# Altium schematic sheet IO_CONN.SchDoc
size A4
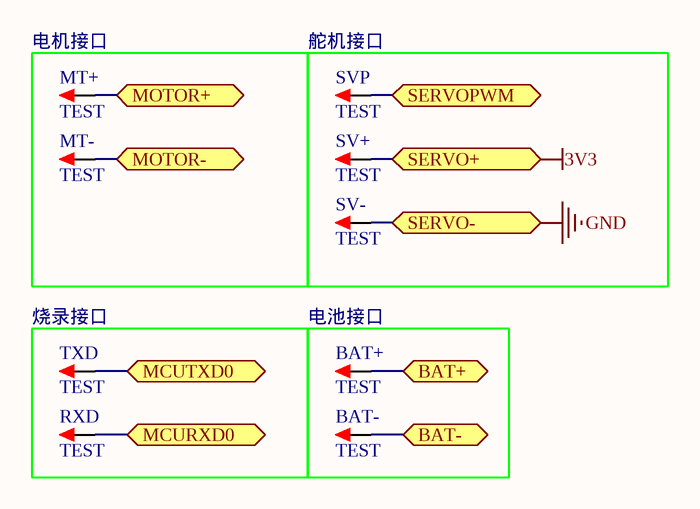
[diagram p0: IO_CONN.SchDoc]

## Parts
BAT+  TEST  [TEST 1.2]
BAT-  TEST  [TEST 1.2]
MT+  TEST  [TEST 1.2]
MT-  TEST  [TEST 1.2]
RXD  TEST  [TEST 1.2]
SV+  TEST  [TEST 1.2]
SV-  TEST  [TEST 1.2]
SVP  TEST  [TEST 1.2]
TXD  TEST  [TEST 1.2]

## Blocks framed on the sheet
舵机接口: SV+ SV- SVP
烧录接口: RXD TXD
电池接口: BAT+ BAT-

## Ports
BAT+ (bidir), BAT- (bidir), MCURXD0 (bidir), MCUTXD0 (bidir), MOTOR+ (bidir), MOTOR- (bidir), SERVO+ (bidir), SERVO- (bidir), SERVOPWM (bidir)

## Nets
3V3: SV+.1 ; port SERVO+
GND: SV-.1 ; port SERVO-
BAT+: BAT+.1 ; port BAT+
BAT-: BAT-.1 ; port BAT-
MCURXD0: RXD.1 ; port MCURXD0
MCUTXD0: TXD.1 ; port MCUTXD0
MOTOR+: MT+.1 ; port MOTOR+
MOTOR-: MT-.1 ; port MOTOR-
SERVOPWM: SVP.1 ; port SERVOPWM

## Notes on the sheet
- (near MT+) 电机接口

## Library data of the parts
BAT+ BAT- MT+ MT- RXD SV+ SV- SVP TXD = TEST: 测试点; 版权归属: 封装库来自淘宝 ID：黄晶宝石; BOM名称: 测试点; 学习资源: https://shop463601444.taobao.com